# Altium schematic sheet ADC-DMUX PSU.SchDoc: <SPECIFIC SHEET FUNCTION>
size A3; Date: DO NOT USE, RATHER USE PROJ OPTIONS; DrawnBy: DO NOT USE, RATHER USE PROJ OPTIONS; Engineer: DO NOT USE, RATHER USE PROJ OPTIONS; Organization: DO NOT USE, RATHER USE PROJ OPTIONS; DocumentNumber: 1; Revision: DO NOT USE, RATHER USE PROJ OPTIONS; SheetNumber: 10; SheetTotal: 12; SCH_Sheet_Filename: ADC-DMUX PSU.SchDoc; CurrentTime: DO NOT USE, RATHER USE PROJ OPTIONS; Time: DO NOT USE, RATHER USE PROJ OPTIONS; DocumentFullPathAndName: DO NOT USE, RATHER USE PROJ OPTIONS; DocumentName: DO NOT USE, RATHER USE PROJ OPTIONS; ModifiedDate: DO NOT USE, RATHER USE PROJ OPTIONS; ImagePath: DO NOT USE, RATHER USE PROJ OPTIONS
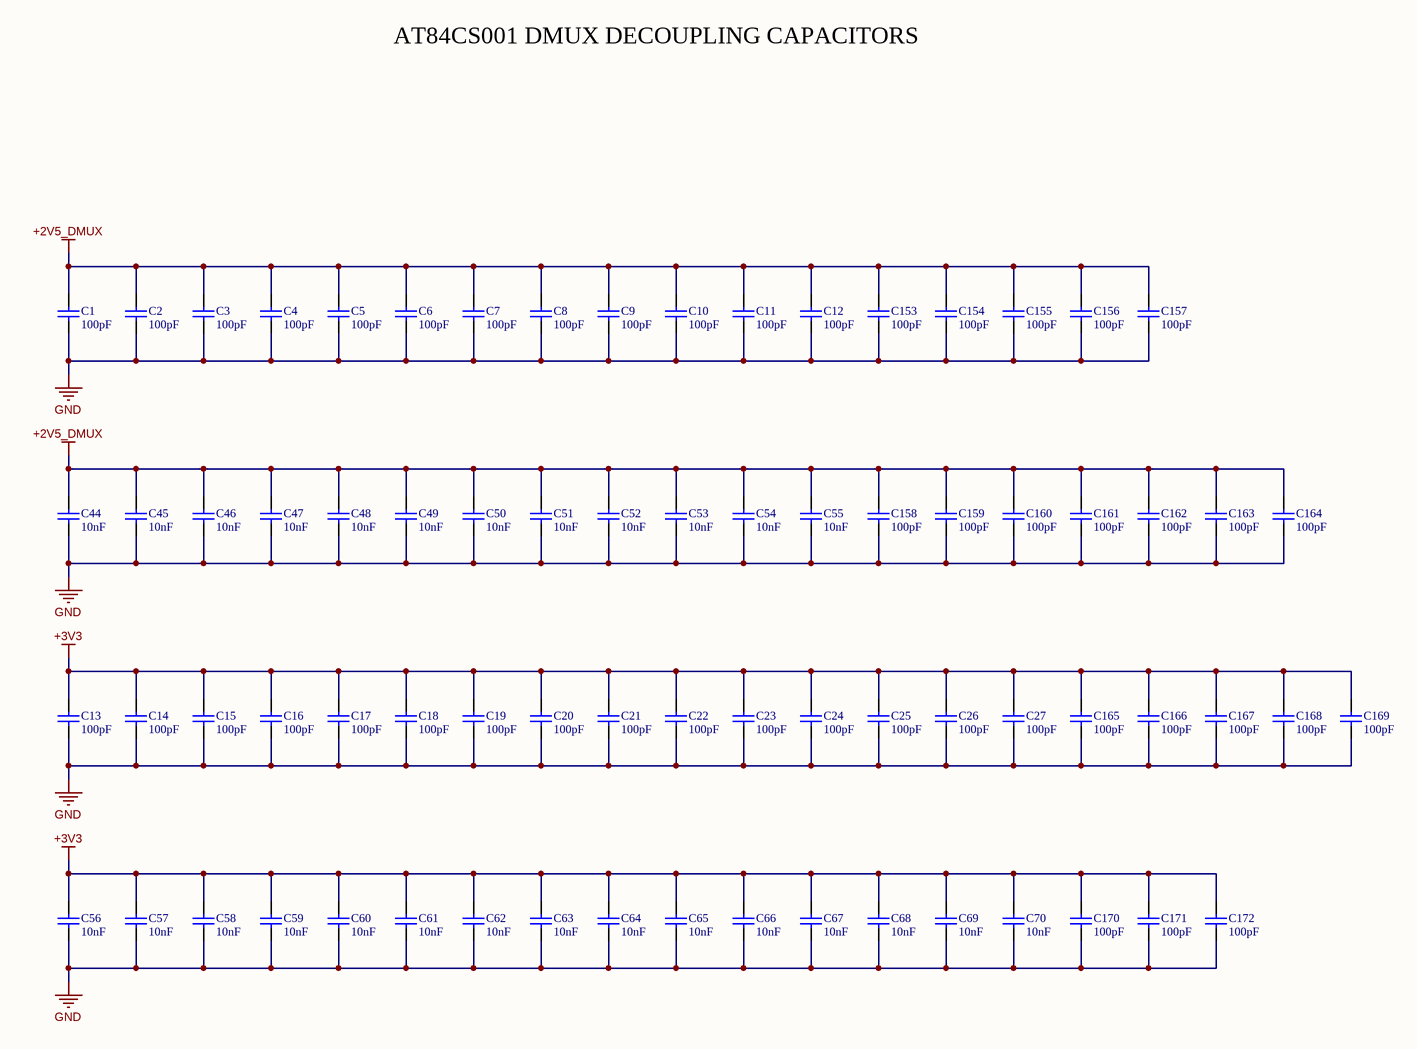
[diagram p0: ADC-DMUX PSU.SchDoc]

## Parts
C1  value 100pF  [CAPC1005X55N]  (hidden comment: Capacitor 0402 SMD)
C2  value 100pF  [CAPC1005X55N]  (hidden comment: Capacitor 0402 SMD)
C3  value 100pF  [CAPC1005X55N]  (hidden comment: Capacitor 0402 SMD)
C4  value 100pF  [CAPC1005X55N]  (hidden comment: Capacitor 0402 SMD)
C5  value 100pF  [CAPC1005X55N]  (hidden comment: Capacitor 0402 SMD)
C6  value 100pF  [CAPC1005X55N]  (hidden comment: Capacitor 0402 SMD)
C7  value 100pF  [CAPC1005X55N]  (hidden comment: Capacitor 0402 SMD)
C8  value 100pF  [CAPC1005X55N]  (hidden comment: Capacitor 0402 SMD)
C9  value 100pF  [CAPC1005X55N]  (hidden comment: Capacitor 0402 SMD)
C10  value 100pF  [CAPC1005X55N]  (hidden comment: Capacitor 0402 SMD)
C11  value 100pF  [CAPC1005X55N]  (hidden comment: Capacitor 0402 SMD)
C12  value 100pF  [CAPC1005X55N]  (hidden comment: Capacitor 0402 SMD)
C13  value 100pF  [CAPC1005X55N]  (hidden comment: Capacitor 0402 SMD)
C14  value 100pF  [CAPC1005X55N]  (hidden comment: Capacitor 0402 SMD)
C15  value 100pF  [CAPC1005X55N]  (hidden comment: Capacitor 0402 SMD)
C16  value 100pF  [CAPC1005X55N]  (hidden comment: Capacitor 0402 SMD)
C17  value 100pF  [CAPC1005X55N]  (hidden comment: Capacitor 0402 SMD)
C18  value 100pF  [CAPC1005X55N]  (hidden comment: Capacitor 0402 SMD)
C19  value 100pF  [CAPC1005X55N]  (hidden comment: Capacitor 0402 SMD)
C20  value 100pF  [CAPC1005X55N]  (hidden comment: Capacitor 0402 SMD)
C21  value 100pF  [CAPC1005X55N]  (hidden comment: Capacitor 0402 SMD)
C22  value 100pF  [CAPC1005X55N]  (hidden comment: Capacitor 0402 SMD)
C23  value 100pF  [CAPC1005X55N]  (hidden comment: Capacitor 0402 SMD)
C24  value 100pF  [CAPC1005X55N]  (hidden comment: Capacitor 0402 SMD)
C25  value 100pF  [CAPC1005X55N]  (hidden comment: Capacitor 0402 SMD)
C26  value 100pF  [CAPC1005X55N]  (hidden comment: Capacitor 0402 SMD)
C27  value 100pF  [CAPC1005X55N]  (hidden comment: Capacitor 0402 SMD)
C44  value 10nF  [CAPC1005X55N]  (hidden comment: Capacitor 0402 SMD)
C45  value 10nF  [CAPC1005X55N]  (hidden comment: Capacitor 0402 SMD)
C46  value 10nF  [CAPC1005X55N]  (hidden comment: Capacitor 0402 SMD)
C47  value 10nF  [CAPC1005X55N]  (hidden comment: Capacitor 0402 SMD)
C48  value 10nF  [CAPC1005X55N]  (hidden comment: Capacitor 0402 SMD)
C49  value 10nF  [CAPC1005X55N]  (hidden comment: Capacitor 0402 SMD)
C50  value 10nF  [CAPC1005X55N]  (hidden comment: Capacitor 0402 SMD)
C51  value 10nF  [CAPC1005X55N]  (hidden comment: Capacitor 0402 SMD)
C52  value 10nF  [CAPC1005X55N]  (hidden comment: Capacitor 0402 SMD)
C53  value 10nF  [CAPC1005X55N]  (hidden comment: Capacitor 0402 SMD)
C54  value 10nF  [CAPC1005X55N]  (hidden comment: Capacitor 0402 SMD)
C55  value 10nF  [CAPC1005X55N]  (hidden comment: Capacitor 0402 SMD)
C56  value 10nF  [CAPC1005X55N]  (hidden comment: Capacitor 0402 SMD)
C57  value 10nF  [CAPC1005X55N]  (hidden comment: Capacitor 0402 SMD)
C58  value 10nF  [CAPC1005X55N]  (hidden comment: Capacitor 0402 SMD)
C59  value 10nF  [CAPC1005X55N]  (hidden comment: Capacitor 0402 SMD)
C60  value 10nF  [CAPC1005X55N]  (hidden comment: Capacitor 0402 SMD)
C61  value 10nF  [CAPC1005X55N]  (hidden comment: Capacitor 0402 SMD)
C62  value 10nF  [CAPC1005X55N]  (hidden comment: Capacitor 0402 SMD)
C63  value 10nF  [CAPC1005X55N]  (hidden comment: Capacitor 0402 SMD)
C64  value 10nF  [CAPC1005X55N]  (hidden comment: Capacitor 0402 SMD)
C65  value 10nF  [CAPC1005X55N]  (hidden comment: Capacitor 0402 SMD)
C66  value 10nF  [CAPC1005X55N]  (hidden comment: Capacitor 0402 SMD)
C67  value 10nF  [CAPC1005X55N]  (hidden comment: Capacitor 0402 SMD)
C68  value 10nF  [CAPC1005X55N]  (hidden comment: Capacitor 0402 SMD)
C69  value 10nF  [CAPC1005X55N]  (hidden comment: Capacitor 0402 SMD)
C70  value 10nF  [CAPC1005X55N]  (hidden comment: Capacitor 0402 SMD)
C153  value 100pF  [CAPC1005X55N]  (hidden comment: Capacitor 0402 SMD)
C154  value 100pF  [CAPC1005X55N]  (hidden comment: Capacitor 0402 SMD)
C155  value 100pF  [CAPC1005X55N]  (hidden comment: Capacitor 0402 SMD)
C156  value 100pF  [CAPC1005X55N]  (hidden comment: Capacitor 0402 SMD)
C157  value 100pF  [CAPC1005X55N]  (hidden comment: Capacitor 0402 SMD)
C158  value 100pF  [CAPC1005X55N]  (hidden comment: Capacitor 0402 SMD)
C159  value 100pF  [CAPC1005X55N]  (hidden comment: Capacitor 0402 SMD)
C160  value 100pF  [CAPC1005X55N]  (hidden comment: Capacitor 0402 SMD)
C161  value 100pF  [CAPC1005X55N]  (hidden comment: Capacitor 0402 SMD)
C162  value 100pF  [CAPC1005X55N]  (hidden comment: Capacitor 0402 SMD)
C163  value 100pF  [CAPC1005X55N]  (hidden comment: Capacitor 0402 SMD)
C164  value 100pF  [CAPC1005X55N]  (hidden comment: Capacitor 0402 SMD)
C165  value 100pF  [CAPC1005X55N]  (hidden comment: Capacitor 0402 SMD)
C166  value 100pF  [CAPC1005X55N]  (hidden comment: Capacitor 0402 SMD)
C167  value 100pF  [CAPC1005X55N]  (hidden comment: Capacitor 0402 SMD)
C168  value 100pF  [CAPC1005X55N]  (hidden comment: Capacitor 0402 SMD)
C169  value 100pF  [CAPC1005X55N]  (hidden comment: Capacitor 0402 SMD)
C170  value 100pF  [CAPC1005X55N]  (hidden comment: Capacitor 0402 SMD)
C171  value 100pF  [CAPC1005X55N]  (hidden comment: Capacitor 0402 SMD)
C172  value 100pF  [CAPC1005X55N]  (hidden comment: Capacitor 0402 SMD)

## Nets
+2V5_DMUX: C1.1 C2.1 C3.1 C4.1 C5.1 C6.1 C7.1 C8.1 C9.1 C10.1 C11.1 C12.1 C44.1 C45.1 C46.1 C47.1 C48.1 C49.1 C50.1 C51.1 C52.1 C53.1 C54.1 C55.1 C153.1 C154.1 C155.1 C156.1 C157.1 C158.1 C159.1 C160.1 C161.1 C162.1 C163.1 C164.1
+3V3: C13.1 C14.1 C15.1 C16.1 C17.1 C18.1 C19.1 C20.1 C21.1 C22.1 C23.1 C24.1 C25.1 C26.1 C27.1 C56.1 C57.1 C58.1 C59.1 C60.1 C61.1 C62.1 C63.1 C64.1 C65.1 C66.1 C67.1 C68.1 C69.1 C70.1 C165.1 C166.1 C167.1 C168.1 C169.1 C170.1 C171.1 C172.1
GND: C1.2 C2.2 C3.2 C4.2 C5.2 C6.2 C7.2 C8.2 C9.2 C10.2 C11.2 C12.2 C13.2 C14.2 C15.2 C16.2 C17.2 C18.2 C19.2 C20.2 C21.2 C22.2 C23.2 C24.2 C25.2 C26.2 C27.2 C44.2 C45.2 C46.2 C47.2 C48.2 C49.2 C50.2 C51.2 C52.2 C53.2 C54.2 C55.2 C56.2 C57.2 C58.2 C59.2 C60.2 C61.2 C62.2 C63.2 C64.2 C65.2 C66.2 C67.2 C68.2 C69.2 C70.2 C153.2 C154.2 C155.2 C156.2 C157.2 C158.2 C159.2 C160.2 C161.2 C162.2 C163.2 C164.2 C165.2 C166.2 C167.2 C168.2 C169.2 C170.2 C171.2 C172.2

## Notes on the sheet
- AT84CS001 DMUX DECOUPLING CAPACITORS
- 2009   THIS DOCUMENT IS THE PROPERTY OF THE OWNER, AND MAY NOT BE COPIED OR USED FOR ANY PURPOSE OTHER THAN THAT FOR WHICH IT IS SUPPLIED WITHOUT PERMISSION IN WRITING FROM THE OWNER.
- C
- DATESTAMP OF THIS PRINT
- DRAWN BY:
- DOCUMENT NUMBER:
- SCHEMATIC FILENAME:
- PCB FILENAME:
- ENGINEER:
- APPROVED:
- CIRCUIT DIAGRAM
- DATE
- SHEET
- REVISION
- OF

## Library data of the parts
C1-C27 C44-C70 C153-C172 = cap0402: Created_By: EDA-ASA; Checked_By: *; Checked_Date: *; HelpURL: *; Supplier1: *; Supplier2: *; Unit_Cost: *; MOQ: *; Leadtime: *; Inventory_Stock: *; Tolerance: *; Wattage: *; Package: 0402; ComponentLinked1Description: *; ComponentLinked1URL: *; ComponentLinked2Description: *; ComponentLinked2URL: *; ComponentLinked3Description: *; ComponentLinked3URL: *; ComponentLinked4Description: *; ComponentLinked4URL: *